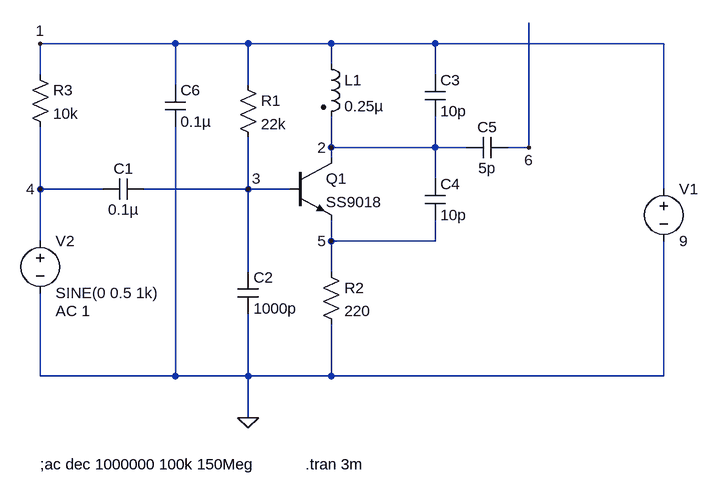
[diagram p0: schematic FMTransmitter.asc]
FMTransmitter.asc, the LTspice schematic file:
Version 4
SHEET 1 3448 1268
WIRE 496 -144 288 -144
WIRE 608 -144 496 -144
WIRE 736 -144 608 -144
WIRE 896 -144 736 -144
WIRE 1248 -144 896 -144
WIRE 736 -112 736 -144
WIRE 288 -96 288 -144
WIRE 896 -96 896 -144
WIRE 496 -80 496 -144
WIRE 608 -80 608 -144
WIRE 736 16 736 -32
WIRE 896 16 896 -32
WIRE 896 16 736 16
WIRE 944 16 896 16
WIRE 1040 16 1040 -176
WIRE 1040 16 1008 16
WIRE 736 32 736 16
WIRE 896 64 896 16
WIRE 288 80 288 -16
WIRE 384 80 288 80
WIRE 608 80 608 0
WIRE 608 80 448 80
WIRE 672 80 608 80
WIRE 1248 80 1248 -144
WIRE 288 160 288 80
WIRE 736 160 736 128
WIRE 896 160 896 128
WIRE 896 160 736 160
WIRE 608 208 608 80
WIRE 736 208 736 160
WIRE 288 368 288 240
WIRE 496 368 496 -16
WIRE 496 368 288 368
WIRE 608 368 608 272
WIRE 608 368 496 368
WIRE 736 368 736 288
WIRE 736 368 608 368
WIRE 1248 368 1248 160
WIRE 1248 368 736 368
WIRE 608 432 608 368
FLAG 608 432 0
FLAG 288 -144 1
FLAG 736 16 2
FLAG 608 80 3
FLAG 288 80 4
FLAG 736 160 5
FLAG 1040 16 6
SYMBOL cap 448 64 R90
WINDOW 0 0 32 VBottom 2
WINDOW 3 32 32 VTop 2
SYMATTR InstName C1
SYMATTR Value 0.1µ
SYMBOL res 592 -96 R0
SYMATTR InstName R1
SYMATTR Value 22k
SYMBOL npn 672 32 R0
SYMATTR InstName Q1
SYMATTR Value SS9018
SYMBOL ind2 720 -128 R0
SYMATTR InstName L1
SYMATTR Value 0.25µ
SYMATTR Type ind
SYMBOL res 720 192 R0
SYMATTR InstName R2
SYMATTR Value 220
SYMBOL cap 880 -96 R0
SYMATTR InstName C3
SYMATTR Value 10p
SYMBOL voltage 1248 64 R0
WINDOW 123 0 0 Left 0
WINDOW 39 0 0 Left 0
SYMATTR InstName V1
SYMATTR Value 9
SYMBOL cap 592 208 R0
SYMATTR InstName C2
SYMATTR Value 1000p
SYMBOL cap 880 64 R0
SYMATTR InstName C4
SYMATTR Value 10p
SYMBOL voltage 288 144 R0
WINDOW 123 24 124 Left 2
WINDOW 39 0 0 Left 0
SYMATTR Value2 AC 1
SYMATTR InstName V2
SYMATTR Value SINE(0 0.5 1k)
SYMBOL cap 1008 0 R90
WINDOW 0 0 32 VBottom 2
WINDOW 3 32 32 VTop 2
SYMATTR InstName C5
SYMATTR Value 5p
SYMBOL res 272 -112 R0
SYMATTR InstName R3
SYMATTR Value 10k
SYMBOL cap 480 -80 R0
SYMATTR InstName C6
SYMATTR Value 0.1µ
TEXT 288 504 Left 2 !;ac dec 1000000 100k 150Meg
TEXT 696 504 Left 2 !.tran 3m

The netlist it stands for:
* FMTransmitter.asc
C1 3 4 0.1µ
R1 1 3 22k
Q1 2 3 5 0 SS9018
L1 1 2 0.25µ
R2 5 0 220
C3 1 2 10p
V1 1 0 9
C2 3 0 1000p
C4 2 5 10p
V2 4 0 SINE(0 0.5 1k) AC 1
C5 6 2 5p
R3 1 4 10k
C6 1 0 0.1µ
.model NPN NPN
.model PNP PNP
.lib standard.bjt
;ac dec 1000000 100k 150Meg
.tran 3m
.backanno
.end